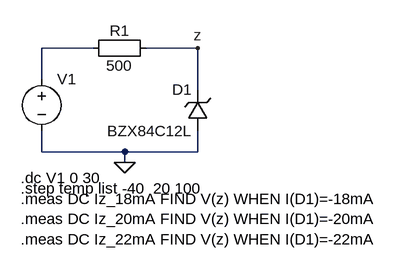
[diagram p0: schematic Z-VA-HV.asc]
Z-VA-HV.asc, the LTspice schematic file:
Version 4
SHEET 1 880 680
WIRE 128 -272 48 -272
WIRE 288 -272 208 -272
WIRE 48 -224 48 -272
WIRE 288 -208 288 -272
WIRE 48 -112 48 -144
WIRE 176 -112 48 -112
WIRE 288 -112 288 -144
WIRE 288 -112 176 -112
WIRE 176 -96 176 -112
FLAG 176 -96 0
FLAG 288 -272 z
SYMBOL Misc\\EuropeanResistor 224 -288 R90
WINDOW 0 5 56 VBottom 2
WINDOW 3 27 56 VTop 2
SYMATTR InstName R1
SYMATTR Value 500
SYMBOL zener 304 -144 R180
WINDOW 0 24 64 Left 2
WINDOW 3 24 0 Left 2
SYMATTR InstName D1
SYMATTR Value BZX84C12L
SYMBOL voltage 48 -240 R0
SYMATTR InstName V1
SYMATTR Value ""
TEXT 16 -72 Left 2 !.dc V1 0 30
TEXT 16 -56 Left 2 !.step temp list -40  20 100
TEXT 16 -40 Left 2 !.meas DC Iz_18mA FIND V(z) WHEN I(D1)=-18mA\n.meas DC Iz_20mA FIND V(z) WHEN I(D1)=-20mA\n.meas DC Iz_22mA FIND V(z) WHEN I(D1)=-22mA

The netlist it stands for:
* Z-VA-HV.asc
R1 z N001 500
D1 0 z BZX84C12L
V1 N001 0
.model D D
.lib standard.dio
.dc V1 0 30
.step temp list -40  20 100
.meas DC Iz_18mA FIND V(z) WHEN I(D1)=-18mA
.meas DC Iz_20mA FIND V(z) WHEN I(D1)=-20mA
.meas DC Iz_22mA FIND V(z) WHEN I(D1)=-22mA
.backanno
.end